# Altium schematic sheet ALLPRINT-CAPBOARD-677512-SIGNAL-INPUTS.SchDoc
size A3; Organization: Altium Limited; Address1: 3 Minna Close; Address2: Belrose; Address3: NSW 2085; Address4: Australia; DocumentNumber: 8; SheetNumber: 7; SheetTotal: 11
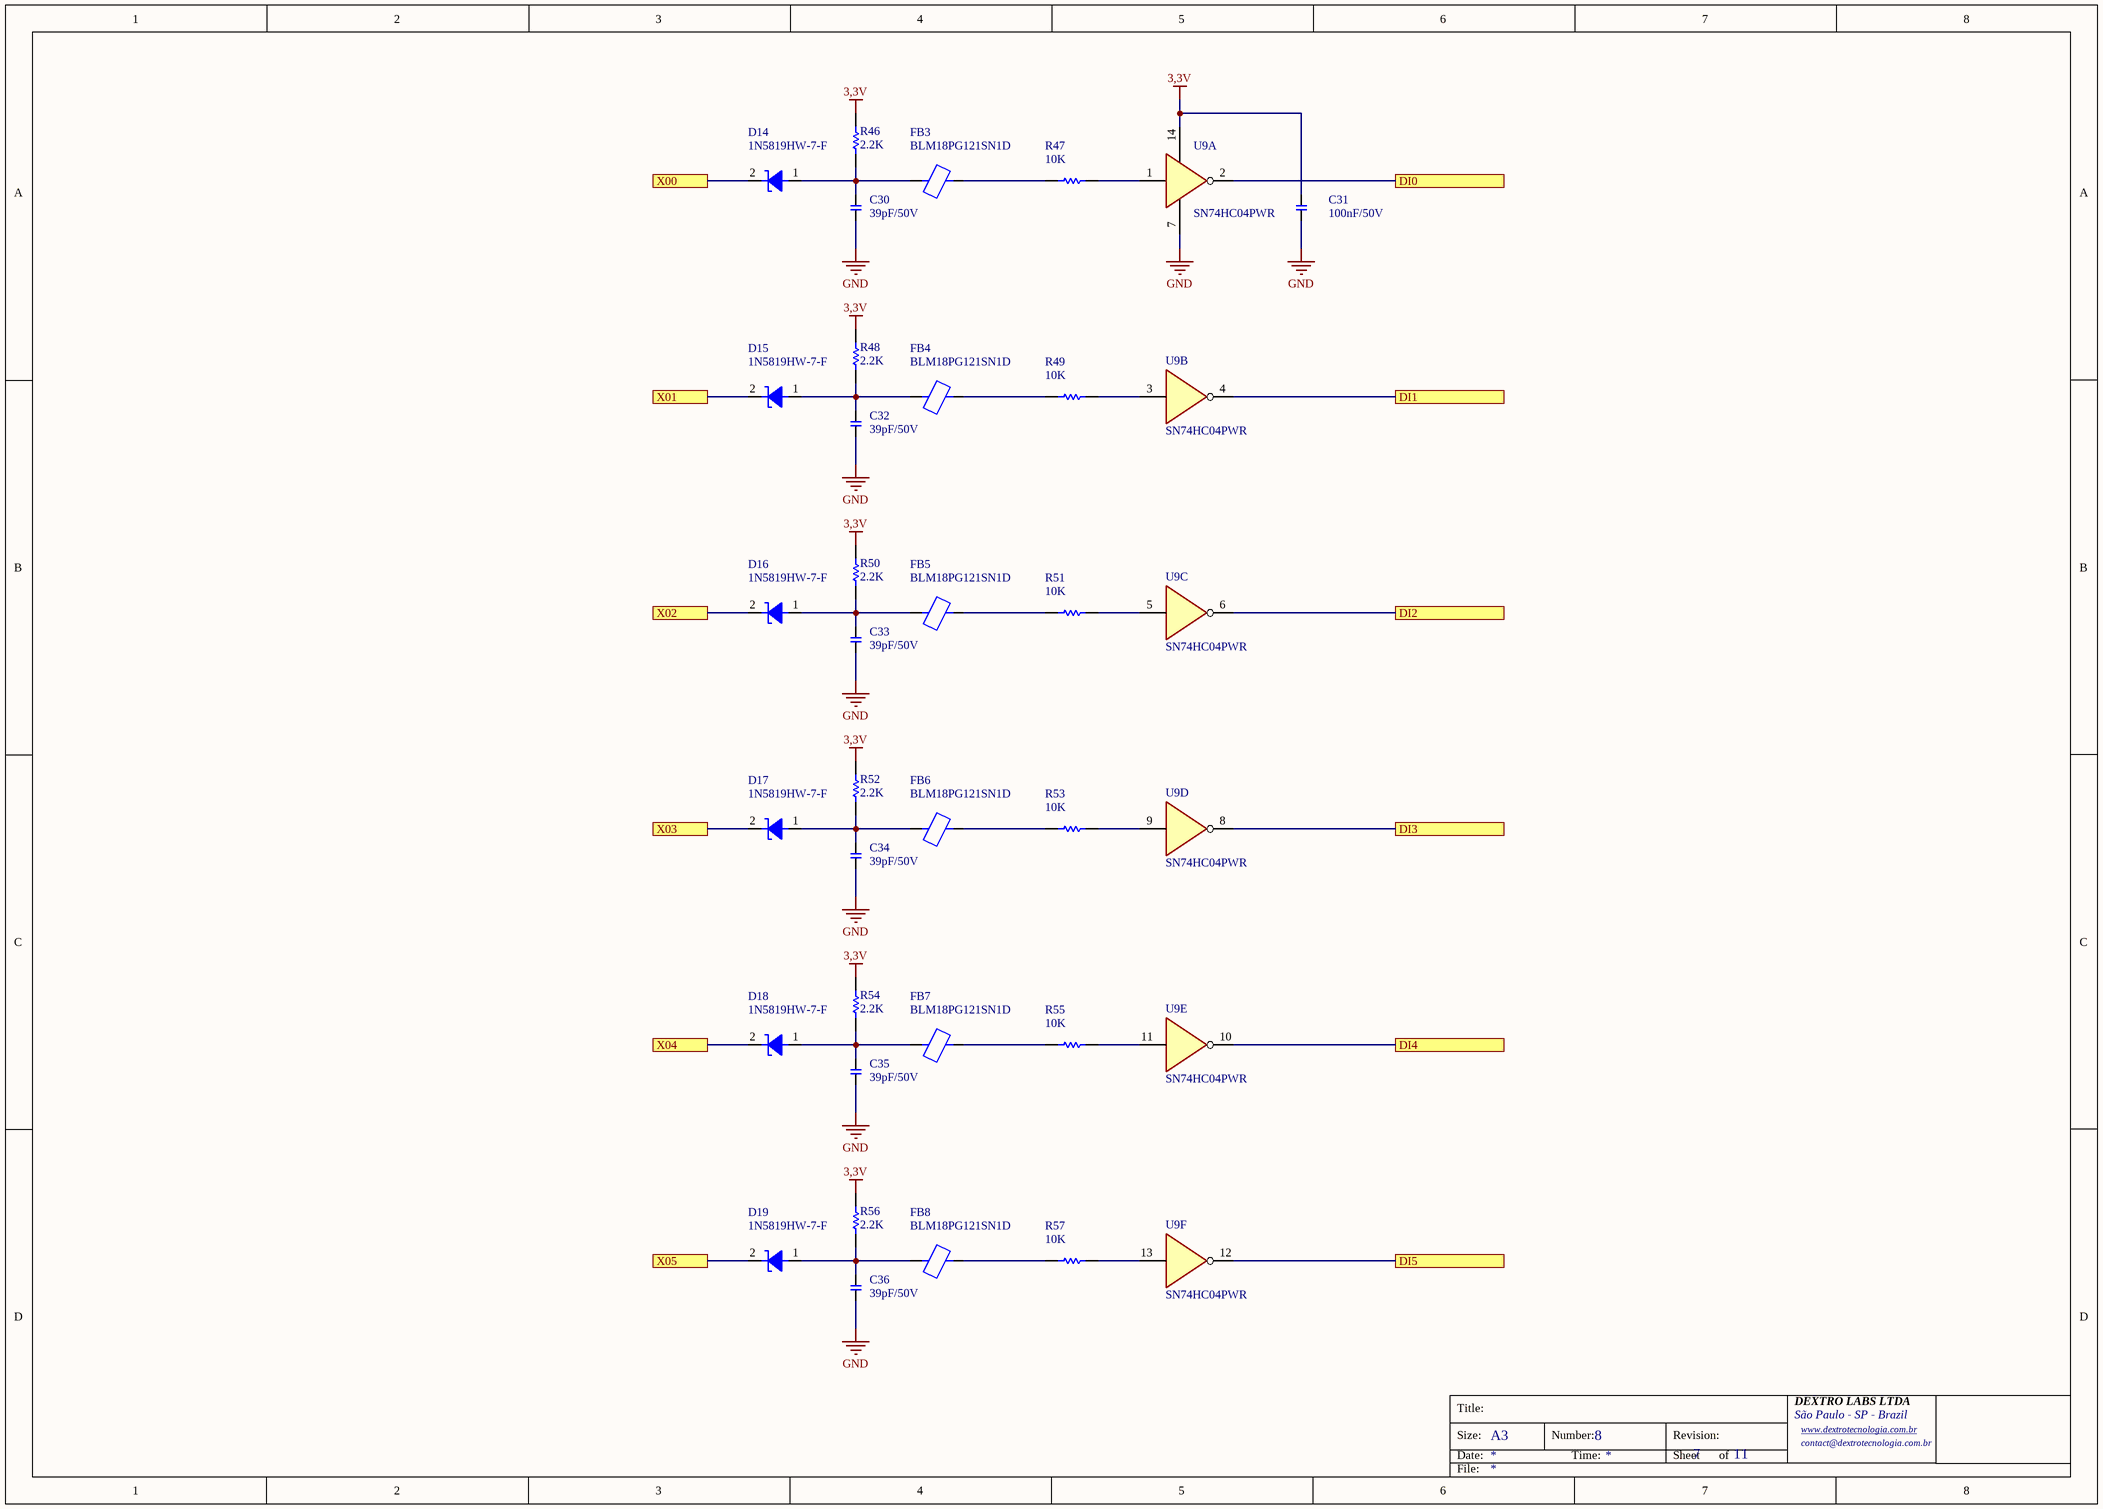
[diagram p0: ALLPRINT-CAPBOARD-677512-SIGNAL-INPUTS.SchDoc]

## Parts
C30  39pF/50V  [CAP-0603]
C31  100nF/50V  [CAP-0603]
C32  39pF/50V  [CAP-0603]
C33  39pF/50V  [CAP-0603]
C34  39pF/50V  [CAP-0603]
C35  39pF/50V  [CAP-0603]
C36  39pF/50V  [CAP-0603]
D14  1N5819HW-7-F  [SOD123]
D15  1N5819HW-7-F  [SOD123]
D16  1N5819HW-7-F  [SOD123]
D17  1N5819HW-7-F  [SOD123]
D18  1N5819HW-7-F  [SOD123]
D19  1N5819HW-7-F  [SOD123]
FB3  BLM18PG121SN1D  [RES-0603]
FB4  BLM18PG121SN1D  [RES-0603]
FB5  BLM18PG121SN1D  [RES-0603]
FB6  BLM18PG121SN1D  [RES-0603]
FB7  BLM18PG121SN1D  [RES-0603]
FB8  BLM18PG121SN1D  [RES-0603]
R46  2.2K  [RES-0805]
R47  10K  [RES-0603]
R48  2.2K  [RES-0805]
R49  10K  [RES-0603]
R50  2.2K  [RES-0805]
R51  10K  [RES-0603]
R52  2.2K  [RES-0805]
R53  10K  [RES-0603]
R54  2.2K  [RES-0805]
R55  10K  [RES-0603]
R56  2.2K  [RES-0805]
R57  10K  [RES-0603]
U9  SN74HC04PWR  [TSSOP-14]  (parts A,B,C,D,E,F of 6)

## Ports
DI0 (see ALLPRINT-CAPBOARD-677512-GENERAL[3B], ALLPRINT-CAPBOARD-677512-MCU[5A]), DI1 (see ALLPRINT-CAPBOARD-677512-GENERAL[3B], ALLPRINT-CAPBOARD-677512-MCU[5A]), DI2 (see ALLPRINT-CAPBOARD-677512-GENERAL[3B], ALLPRINT-CAPBOARD-677512-MCU[5A]), DI3 (see ALLPRINT-CAPBOARD-677512-GENERAL[3B], ALLPRINT-CAPBOARD-677512-MCU[5A]), DI4 (see ALLPRINT-CAPBOARD-677512-GENERAL[3B], ALLPRINT-CAPBOARD-677512-MCU[5B]), DI5 (see ALLPRINT-CAPBOARD-677512-GENERAL[3B], ALLPRINT-CAPBOARD-677512-MCU[5B]), X00 (see ALLPRINT-CAPBOARD-677512-GENERAL[4B]), X01 (see ALLPRINT-CAPBOARD-677512-GENERAL[4B]), X02 (see ALLPRINT-CAPBOARD-677512-GENERAL[4B]), X03 (see ALLPRINT-CAPBOARD-677512-GENERAL[4B]), X04 (see ALLPRINT-CAPBOARD-677512-GENERAL[4B]), X05 (see ALLPRINT-CAPBOARD-677512-GENERAL[4B])

## Nets
3,3V: C31.2 R46.1 R48.1 R50.1 R52.1 R54.1 R56.1 U9.14(VCC)
GND: C30.1 C31.1 C32.1 C33.1 C34.1 C35.1 C36.1 U9.7(GND)
DI0: U9.2(1Y) ; port DI0
DI1: U9.4(2Y) ; port DI1
DI2: U9.6(3Y) ; port DI2
DI3: U9.8(4Y) ; port DI3
DI4: U9.10(5Y) ; port DI4
DI5: U9.12(6Y) ; port DI5
X00: D14.2 ; port X00
X01: D15.2 ; port X01
X02: D16.2 ; port X02
X03: D17.2 ; port X03
X04: D18.2 ; port X04
X05: D19.2 ; port X05
NetC30_2: C30.2 D14.1 FB3.1 R46.2
NetC32_2: C32.2 D15.1 FB4.1 R48.2
NetC33_2: C33.2 D16.1 FB5.1 R50.2
NetC34_2: C34.2 D17.1 FB6.1 R52.2
NetC35_2: C35.2 D18.1 FB7.1 R54.2
NetC36_2: C36.2 D19.1 FB8.1 R56.2
NetFB3_2: FB3.2 R47.1
NetFB4_2: FB4.2 R49.1
NetFB5_2: FB5.2 R51.1
NetFB6_2: FB6.2 R53.1
NetFB7_2: FB7.2 R55.1
NetFB8_2: FB8.2 R57.1
NetR47_2: R47.2 U9.1(1A)
NetR49_2: R49.2 U9.3(2A)
NetR51_2: R51.2 U9.5(3A)
NetR53_2: R53.2 U9.9(4A)
NetR55_2: R55.2 U9.11(5A)
NetR57_2: R57.2 U9.13(6A)

## Notes on the sheet
- Title:
- Size:
- Date:
- A3
- Number:
- Time:
- Revision:
- Sheet
- of
- DEXTRO LABS LTDA
- São Paulo - SP - Brazil
- www.dextrotecnologia.com.br <http://www.dextrotecnologia.com.br>
- contact@dextrotecnologia.com.br
- File:

## Library data of the parts
C30 C32-C36 = CAP-39pF/50V-0603-X7R-MLCC: 50V 39pF X7R ±10% 0603 Multilayer Ceramic Capacitors MLCC - SMD/SMT ROHS; LCSC: C107049
C31 = CAP-100nF/50V-0603-X7R-MLCC: 50V 100nF X7R ±10% 0603 Multilayer Ceramic Capacitors MLCC - SMD/SMT ROHS; LCSC: C14663
D14-D19 = 1N5819HW-7-F: 25A 1 Independent 40V 450mV@1A 1A SOD-123 Single Diodes RoHS; LCSC: C82544
FB3-FB8 = BLM18PG121SN1D: FERRITE BEAD 120Ω 0603 1LN; LCSC: C14709
R46 R48 R50 R52 R54 R56 = RES-2.2K-1%-125mW-0805: 125mW 2.2kΩ 150V ±100ppm/℃ Thick Film Resistor ±1% 0805 Chip Resistor - Surface Mount ROHS; LCSC: C2907234
R47 R49 R51 R53 R55 R57 = RES-10K-1%-100mW-0603: 100mW Thick Film Resistor 75V ±100ppm/℃ ±1% 10kΩ 0603 Chip Resistor - Surface Mount ROHS; LCSC: C98220
U9 = SN74HC04PWR: 2V~6V 16ns@6V,50pF 2uA 6 1 TSSOP-14 Gates and Inverters RoHS; LCSC: C6810